# Altium schematic sheet RF PATH.SchDoc: RF PATH
size B; SheetNumber: 5; SheetTotal: 8
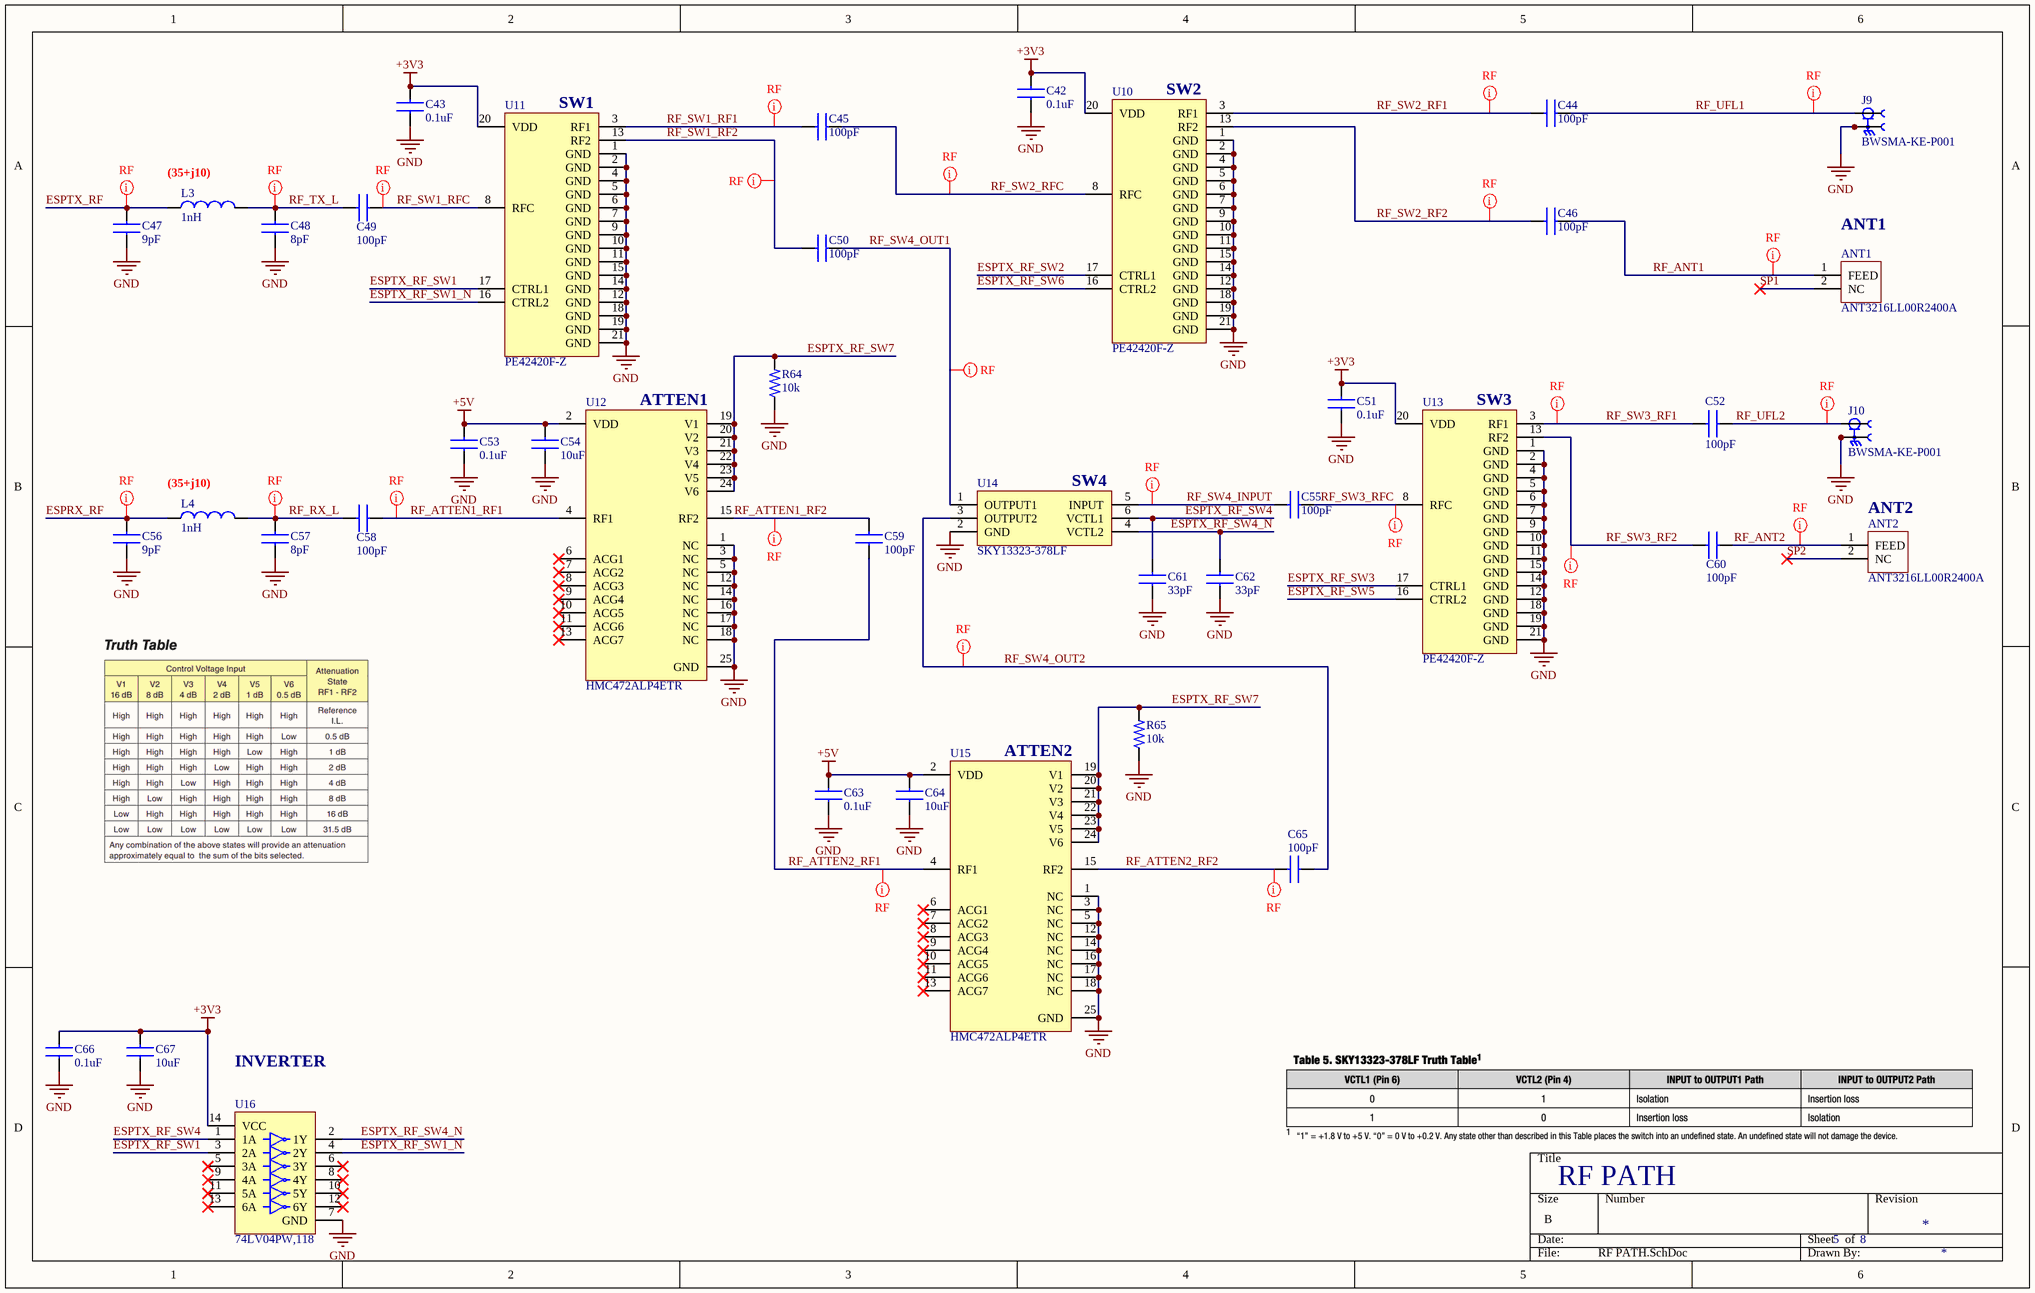
[diagram p0: RF PATH.SchDoc]

## Parts
ANT1  ANT3216LL00R2400A  [ANT_ANT3216LL00R2400A]
ANT2  ANT3216LL00R2400A  [ANT_ANT3216LL00R2400A]
C42  0.1uF  [CAP_0402]
C43  0.1uF  [CAP_0402]
C44  100pF  [CAP_0402]
C45  100pF  [CAP_0402]
C46  100pF  [CAP_0402]
C47  9pF  [CAP_0402]
C48  8pF  [CAP_0402]
C49  100pF  [CAP_0402]
C50  100pF  [CAP_0402]
C51  0.1uF  [CAP_0402]
C52  100pF  [CAP_0402]
C53  0.1uF  [CAP_0402]
C54  10uF  [CAP_0402]
C55  100pF  [CAP_0402]
C56  9pF  [CAP_0402]
C57  8pF  [CAP_0402]
C58  100pF  [CAP_0402]
C59  100pF  [CAP_0402]
C60  100pF  [CAP_0402]
C61  33pF  [CAP_0402]
C62  33pF  [CAP_0402]
C63  0.1uF  [CAP_0402]
C64  10uF  [CAP_0402]
C65  100pF  [CAP_0402]
C66  0.1uF  [CAP_0402]
C67  10uF  [CAP_0402]
J9  BWSMA-KE-P001  [CONN_BWSMA-KE-P001]
J10  BWSMA-KE-P001  [CONN_BWSMA-KE-P001]
L3  1nH  [INDUCTOR_0402]
L4  1nH  [INDUCTOR_0402]
R64  10k  [RES_0402]
R65  10k  [RES_0402]
U10  PE42420F-Z  [RF_PE42420F-Z]
U11  PE42420F-Z  [RF_PE42420F-Z]
U12  HMC472ALP4ETR  [IC_HMC472ALP4ETR]
U13  PE42420F-Z  [RF_PE42420F-Z]
U14  SKY13323-378LF  [RF_SW_SKYA21012]
U15  HMC472ALP4ETR  [IC_HMC472ALP4ETR]
U16  74LV04PW,118  [TSSOP14]

## Nets
+3V3: C42.2 C43.2 C51.2 C66.2 C67.2 U10.20(VDD) U11.20(VDD) U13.20(VDD) U16.14(VCC)
+5V: C53.2 C54.2 C63.2 C64.2 U12.2(VDD) U15.2(VDD)
GND: C42.1 C43.1 C47.1 C48.1 C51.1 C53.1 C54.1 C56.1 C57.1 C61.1 C62.1 C63.1 C64.1 C66.1 C67.1 J9.2 J9.3 J9.4 J9.5 J10.2 J10.3 J10.4 J10.5 R64.1 R65.1 U10.1(GND) U10.2(GND) U10.4(GND) U10.5(GND) U10.6(GND) U10.7(GND) U10.9(GND) U10.10(GND) U10.11(GND) U10.12(GND) U10.14(GND) U10.15(GND) U10.18(GND) U10.19(GND) U10.21(GND) U11.1(GND) U11.2(GND) U11.4(GND) U11.5(GND) U11.6(GND) U11.7(GND) U11.9(GND) U11.10(GND) U11.11(GND) U11.12(GND) U11.14(GND) U11.15(GND) U11.18(GND) U11.19(GND) U11.21(GND) U12.1(NC) U12.3(NC) U12.5(NC) U12.12(NC) U12.14(NC) U12.16(NC) U12.17(NC) U12.18(NC) U12.25(GND) U13.1(GND) U13.2(GND) U13.4(GND) U13.5(GND) U13.6(GND) U13.7(GND) U13.9(GND) U13.10(GND) U13.11(GND) U13.12(GND) U13.14(GND) U13.15(GND) U13.18(GND) U13.19(GND) U13.21(GND) U14.2(GND) U15.1(NC) U15.3(NC) U15.5(NC) U15.12(NC) U15.14(NC) U15.16(NC) U15.17(NC) U15.18(NC) U15.25(GND) U16.7(GND)
ESPRX_RF: C56.2 L4.1
ESPTX_RF: C47.2 L3.1
ESPTX_RF_SW1: U11.17(CTRL1) U16.3(2A)
ESPTX_RF_SW1_N: U11.16(CTRL2) U16.4(2Y)
ESPTX_RF_SW2: U10.17(CTRL1)
ESPTX_RF_SW3: U13.17(CTRL1)
ESPTX_RF_SW4: C61.2 U14.6(VCTL1) U16.1(1A)
ESPTX_RF_SW4_N: C62.2 U14.4(VCTL2) U16.2(1Y)
ESPTX_RF_SW5: U13.16(CTRL2)
ESPTX_RF_SW6: U10.16(CTRL2)
ESPTX_RF_SW7: R64.2 R65.2 U12.19(V1) U12.20(V2) U12.21(V3) U12.22(V4) U12.23(V5) U12.24(V6) U15.19(V1) U15.20(V2) U15.21(V3) U15.22(V4) U15.23(V5) U15.24(V6)
RF_ANT1: ANT1.1(FEED) C46.2
RF_ANT2: ANT2.1(FEED) C60.1
RF_ATTEN1_RF1: C58.1 U12.4(RF1)
RF_ATTEN1_RF2: C59.2 U12.15(RF2)
RF_ATTEN2_RF1: C59.1 U15.4(RF1)
RF_ATTEN2_RF2: C65.2 U15.15(RF2)
RF_RX_L: C57.2 C58.2 L4.2
RF_SW1_RF1: C45.1 U11.3(RF1)
RF_SW1_RF2: C50.2 U11.13(RF2)
RF_SW1_RFC: C49.1 U11.8(RFC)
RF_SW2_RF1: C44.1 U10.3(RF1)
RF_SW2_RF2: C46.1 U10.13(RF2)
RF_SW2_RFC: C45.2 U10.8(RFC)
RF_SW3_RF1: C52.1 U13.3(RF1)
RF_SW3_RF2: C60.2 U13.13(RF2)
RF_SW3_RFC: C55.1 U13.8(RFC)
RF_SW4_INPUT: C55.2 U14.5(INPUT)
RF_SW4_OUT1: C50.1 U14.1(OUTPUT1)
RF_SW4_OUT2: C65.1 U14.3(OUTPUT2)
RF_TX_L: C48.2 C49.2 L3.2
RF_UFL1: C44.2 J9.1
RF_UFL2: C52.2 J10.1
SP1: ANT1.2(NC)
SP2: ANT2.2(NC)

Not connected (* = marked no-connect by the designer): U12 6(ACG1)* 7(ACG2)* 8(ACG3)* 9(ACG4)* 10(ACG5)* 11(ACG6)* 13(ACG7)*; U15 6(ACG1)* 7(ACG2)* 8(ACG3)* 9(ACG4)* 10(ACG5)* 11(ACG6)* 13(ACG7)*; U16 5(3A)* 6(3Y)* 8(4Y)* 9(4A)* 10(5Y)* 11(5A)* 12(6Y)* 13(6A)*

## Layout directives
net class RF: ESPRX_RF, ESPTX_RF, RF_ANT1, RF_ANT2, RF_ATTEN1_RF1, RF_ATTEN1_RF2, RF_ATTEN2_RF1, RF_ATTEN2_RF2, RF_RX_L, RF_SW1_RF1, RF_SW1_RF2, RF_SW1_RFC, RF_SW2_RF1, RF_SW2_RF2, RF_SW2_RFC, RF_SW3_RF1, RF_SW3_RF2, RF_SW3_RFC, RF_SW4_INPUT, RF_SW4_OUT1, RF_SW4_OUT2, RF_TX_L, RF_UFL1, RF_UFL2

## Notes on the sheet
- (near U10) SW2
- (near U11) SW1
- (near L3) (35+j10)
- (near ANT1) ANT1
- (near U12) ATTEN1
- (near U13) SW3
- (near L4) (35+j10)
- (near U14) SW4
- (near ANT2) ANT2
- (near U15) ATTEN2
- INVERTER

## Library data of the parts
ANT1 ANT2 = ANT_ANT3216LL00R2400A: Chip Antenna Linear Single Band 50Ohm 2.4GHz 5.05dBi 2-Pin SMD T/R; Manufacturer: Yageo; Number of Bands: 1; Max Power Dissipation: 1W; Supplier 1: Digi-Key; Manufacturer Part Number: ANT3216LL00R2400A; RoHS: Yes; Category: RF Antennas; Mount: Surface Mount; Packaging: Cut Tape; Termination: Solder; ComponentLink1URL: http://www.yageo.com/NewPortal/_en/search/productDocs.jsp?YageoPartNumber=ANT3216LL00R2400A&src-supplier=Digi-Key; ComponentLink1Description: http://www.yageo.com/NewPortal/_en/search/productDocs.jsp?YageoPartNumber=ANT3216LL00R2400A&src-supplier=Digi-Key; Supplier Part Number 1: 311-4590-2-ND
C42 C43 C51 C53 C63 C66 = CAP_GCM155R71C104KA55J: Cap Ceramic 0.1uF 16V X7R 10% SMD 0402 125C Paper T/R; Manufacturer: Murata; Capacitance: 100nF; Supplier 1: Digi-Key; Manufacturer Part Number: GCM155R71C104KA55J; RoHS: Yes; Category: Ceramic Capacitors; Stock 1: 10738061; Pricing 1: 1=0.10000, 10=0.03500, 50=0.01920, 100=0.01560, 500=0.01116, 1000=0.00877, 2500=0.00798, 5000=0.00734 (USD); Mount: Surface Mount; Case/Package: 0402; Case Code (Imperial): 0402; Case Code (Metric): 1005; Min Operating Temperature: -55°C; Max Operating Temperature: 125°C; Tolerance: 10%; Voltage Rating: 16V; Voltage Rating (DC): 16V; Packaging: Tape and Reel; Package Quantity: 1; Dielectric: X7R; Termination: SMD/SMT; Series: GCM; Construction: Flat; Length: 1mm; Width: 0.5mm; Height: 0.5mm; Thickness: 0.022inch; Depth: 0.5mm; Ratings: AEC-Q200; Radiation Hardening: No; Lead Free: Lead Free; ComponentLink1URL: https://datasheet.ciiva.com/11618/product-11618848.pdf?src-supplier=Avnet; ComponentLink1Description: https://datasheet.ciiva.com/11618/product-11618848.pdf?src-supplier=Avnet; ComponentLink2URL: https://datasheet.ciiva.com/16440/gcm155r71c104ka55j-16440393.pdf?src-supplier=Future+Electronics; ComponentLink2Description: https://datasheet.ciiva.com/16440/gcm155r71c104ka55j-16440393.pdf?src-supplier=Future+Electronics; ComponentLink3URL: https://datasheet.ciiva.com/29542/product-29542474.pdf?src-supplier=Digi-Key; ComponentLink3Description: https://datasheet.ciiva.com/29542/product-29542474.pdf?src-supplier=Digi-Key; ComponentLink4URL: https://datasheet.ciiva.com/29542/product-29542475.pdf?src-supplier=Digi-Key; ComponentLink4Description: https://datasheet.ciiva.com/29542/product-29542475.pdf?src-supplier=Digi-Key; Supplier Part Number 1: 490-7998-1-ND
C44-C46 C49 C50 C52 C55 C58-C60 C65 = CAP_CC0402JRNPO9BN101: 0402 100 pF 50 V ±5 % Tolerance NP0 SMT Multilayer Ceramic Capacitor; Manufacturer: Yageo; Tolerance: 5%; Voltage Rating: 50V; Dielectric: C0G; Temperature Coefficient: 30ppm/°C; Insulation Resistance: 100GR; Supplier 1: Digi-Key; Manufacturer Part Number: CC0402JRNPO9BN101; RoHS: Yes; Category: Ceramic Capacitors; Stock 1: 12718535; Pricing 1: 1=0.1, 10=0.017, 50=0.0096, 100=0.0078, 500=0.00554, 1000=0.00436, 2500=0.00396, 5000=0.00365 (USD); Mounting Technology: Surface Mount; Case/Package: 0402; Pins: 2; Case Code (Imperial): 0402; Case Code (Metric): 1005; Dielectric Material: Ceramic; Min Operating Temperature: -55°C; Max Operating Temperature: 125°C; Value: 100pF; Voltage Rating (DC): 50V; Packaging: Tape and Reel; Package Quantity: 1; Termination: SMD/SMT; Voltage: 50V; Series: CC; Length: 1mm; Width: 0.02inch; Height: 0.5mm; Thickness: 0.022inch; Depth: 0.5mm; Radiation Hardening: No; Reach SVHC Compliant: No; Lead Free: Lead Free; RoHS Compliant: Yes; ComponentLink1URL: https://datasheet.ciiva.com/23767/25787-23767888.pdf?src-supplier=Newark; ComponentLink1Description: https://datasheet.ciiva.com/23767/25787-23767888.pdf?src-supplier=Newark; ComponentLink2URL: https://datasheet.ciiva.com/11786/0900766b80d84fbf-11786101.pdf?src-supplier=Rs; ComponentLink2Description: https://datasheet.ciiva.com/11786/0900766b80d84fbf-11786101.pdf?src-supplier=Rs; ComponentLink3URL: https://datasheet.ciiva.com/28450/1443161-28450220.pdf?src-supplier=Element14; ComponentLink3Description: https://datasheet.ciiva.com/28450/1443161-28450220.pdf?src-supplier=Element14; ComponentLink4URL: https://datasheet.ciiva.com/8033/1443161-8033598.pdf?src-supplier=Element14; ComponentLink4Description: https://datasheet.ciiva.com/8033/1443161-8033598.pdf?src-supplier=Element14; ComponentLink5URL: https://datasheet.ciiva.com/143/mlccorderingcode-143990.pdf?src-supplier=Digi-Key; ComponentLink5Description: https://datasheet.ciiva.com/143/mlccorderingcode-143990.pdf?src-supplier=Digi-Key; ComponentLink6URL: https://datasheet.ciiva.com/143/mlccorderingcode-143989.pdf?src-supplier=Digi-Key; ComponentLink6Description: https://datasheet.ciiva.com/143/mlccorderingcode-143989.pdf?src-supplier=Digi-Key; ComponentLink7URL: https://datasheet.ciiva.com/143/mlccorderingcode-143991.pdf?src-supplier=Digi-Key; ComponentLink7Description: https://datasheet.ciiva.com/143/mlccorderingcode-143991.pdf?src-supplier=Digi-Key; Supplier Part Number 1: 311-1024-1-ND
C47 C56 = CAP_GJM1555C1H9R0WB01D: Cap Ceramic 9pF 50V C0G 0.05pF SMD 0402 125°C Paper T/R; Manufacturer: Murata; Supplier 1: Digi-Key; Manufacturer Part Number: GJM1555C1H9R0WB01D; RoHS: Yes; Category: Ceramic Capacitors; Stock 1: 62783; Pricing 1: 1=0.19, 10=0.131, 50=0.0786, 100=0.0664, 500=0.04542, 1000=0.04019, 2500=0.03844, 5000=0.03495 (USD); Mounting Technology: Surface Mount; Case/Package: 0402; Case Code (Metric): 1005; Case Code (Imperial): 0402; Min Operating Temperature: -55°C; Max Operating Temperature: 125°C; Package Quantity: 10000; Value: 9pF; Voltage Rating: 50V; Packaging: Tape and Reel; Dielectric: C0G; Termination: SMD/SMT; Voltage Rating (DC): 50V; Series: GJM; Construction: Flat; Length: 1mm; Width: 0.02inch; Height: 0.5mm; Thickness: 0.022inch; Depth: 0.5mm; Radiation Hardening: No; RoHS Compliant: Yes; ComponentLink1URL: https://datasheet.ciiva.com/169/product-169670.pdf?src-supplier=Digi-Key; ComponentLink1Description: https://datasheet.ciiva.com/169/product-169670.pdf?src-supplier=Digi-Key; ComponentLink2URL: https://datasheet.ciiva.com/11609/product-11609469.pdf?src-supplier=Avnet; ComponentLink2Description: https://datasheet.ciiva.com/11609/product-11609469.pdf?src-supplier=Avnet; Supplier Part Number 1: 490-11242-1-ND
C48 C57 = CAP_CBR04C809B1GAC: Cap Ceramic 8pF 100V C0G 0.1pF SMD 0402 125°C Punched Paper T/R; Manufacturer: KEMET; Supplier 1: Digi-Key; Manufacturer Part Number: CBR04C809B1GAC; RoHS: Yes; Category: Ceramic Capacitors; Stock 1: 120216; Pricing 1: 1=0.31, 10=0.214, 50=0.1426, 100=0.1212, 500=0.08556, 1000=0.07487, 2500=0.0713, 5000=0.06596 (USD); Mounting Technology: Surface Mount; Case/Package: 0402; Case Code (Metric): 1005; Case Code (Imperial): 0402; Min Operating Temperature: -55°C; Max Operating Temperature: 125°C; Package Quantity: 1; Value: 8pF; Voltage Rating: 100V; Packaging: Cut Tape; Voltage Rating (DC): 100V; Series: CBR; Length: 0.039inch; Width: 0.02inch; Thickness: 0.022inch; RoHS Compliant: Yes; ComponentLink1URL: https://datasheet.ciiva.com/6257/kem-c1030-cbr-smd-6257486.pdf?src-supplier=Digi-Key; ComponentLink1Description: https://datasheet.ciiva.com/6257/kem-c1030-cbr-smd-6257486.pdf?src-supplier=Digi-Key; Supplier Part Number 1: 399-8830-1-ND
C54 C64 C67 = CAP_CL05A106MQ5NUNC: Cap Ceramic 10uF 6.3V X5R 20% SMD 0402 85°C Paper T/R; Manufacturer: Samsung; Supplier 1: Digi-Key; Manufacturer Part Number: CL05A106MQ5NUNC; RoHS: Yes; Category: Ceramic Capacitors; Stock 1: 3345553; Pricing 1: 1=0.27000, 10=0.18400, 50=0.11020, 100=0.09300, 500=0.06362, 1000=0.05629, 2500=0.05384, 5000=0.04894 (USD); Mount: Surface Mount; Case/Package: 0402; Case Code (Metric): 1005; Case Code (Imperial): 0402; Min Operating Temperature: -55°C; Max Operating Temperature: 85°C; Tolerance: 20%; Capacitance: 10uF; Dielectric: X5R; Packaging: Tape and Reel; Package Quantity: 1; Voltage Rating: 6.3V; Series: CL; Construction: Flat; Length: 1mm; Width: 0.02inch; Height: 0.5mm; Thickness: 0.028inch; Depth: 0.5mm; Radiation Hardening: No; ComponentLink1URL: https://datasheet.ciiva.com/16437/cl05a106mq5nunc-16437356.pdf?src-supplier=Future+Electronics; ComponentLink1Description: https://datasheet.ciiva.com/16437/cl05a106mq5nunc-16437356.pdf?src-supplier=Future+Electronics; ComponentLink2URL: https://datasheet.ciiva.com/26877/getdatasheetpartid-355289-26877841.pdf?src-supplier=Verical; ComponentLink2Description: https://datasheet.ciiva.com/26877/getdatasheetpartid-355289-26877841.pdf?src-supplier=Verical; Supplier Part Number 1: 1276-1451-1-ND
C61 C62 = CAP_CL05C330JB5NNNC: Ceramic capacitor SMD-0402 33pF /50V C0G# J +-5%, Samsung, RoHS; Tolerance: 5%; Voltage Rating: 50V; Dielectric: C0G; Temperature Coefficient: 300ppm/°C; Supplier 1: Digi-Key; Manufacturer: Samsung; Manufacturer Part Number: CL05C330JB5NNNC; RoHS: Yes; Category: Ceramic Capacitors; Stock 1: 9061474; Pricing 1: 1=0.1, 10=0.023, 50=0.0126, 100=0.0102, 500=0.00732, 1000=0.00575, 2500=0.00523, 5000=0.00481 (USD); Mounting Technology: Surface Mount; Case/Package: 0402; Case Code (Metric): 1005; Case Code (Imperial): 0402; Material: Ceramic; Min Operating Temperature: -55°C; Max Operating Temperature: 125°C; Package Quantity: 1; Packaging: Tape and Reel; Value: 33pF; Voltage: 50V; Voltage Rating (DC): 50V; Series: CL; Construction: Flat; Length: 1mm; Width: 0.02inch; Height: 0.5mm; Thickness: 0.022inch; Depth: 0.5mm; Radiation Hardening: No; Lead Free: Lead Free; RoHS Compliant: Yes; ComponentLink1URL: https://datasheet.ciiva.com/15195/getdatasheetpartid-355282-15195687.pdf?src-supplier=Verical; ComponentLink1Description: https://datasheet.ciiva.com/15195/getdatasheetpartid-355282-15195687.pdf?src-supplier=Verical; ComponentLink2URL: https://datasheet.ciiva.com/29198/458594-da-01-en-vs-kondensator-0402-29198402.pdf?src-supplier=Conrad; ComponentLink2Description: https://datasheet.ciiva.com/29198/458594-da-01-en-vs-kondensator-0402-29198402.pdf?src-supplier=Conrad; Supplier Part Number 1: 1276-1272-1-ND
J9 J10 = CONN_BWSMA-KE-P001: 0-12.4GHz 50Ω 335V 直插偏脚; Manufacturer: BAT Wireless; Supplier 1: LCSC; Manufacturer Part Number: BWSMA-KE-P001; RoHS: No; Stock 1: 21382; Pricing 1: 1=0.3453, 10=0.2721, 30=0.2355, 100=0.2037, 500=0.1957, 1000=0.1894 (USD); Supplier Part Number 1: C496550
L3 L4 = L_LQG15HS1N0S02D: Inductor RF Chip Multi-Layer 1nH 0.3nH 100MHz 8Q-Factor Air 1A 70mOhm DCR 0402 T/R; Manufacturer: Murata; Q Factor: 8; Current Rating: 300mA; Shielding: Unshielded; Self Resonant Frequency: 10GHz; DC Resistance (DCR): 70mR; Supplier 1: LCSC; Manufacturer Part Number: LQG15HS1N0S02D; RoHS: Yes; Category: Fixed Inductors; Stock 1: 12000; Pricing 1: 100=0.0076, 1000=0.0064, 3000=0.0057, 10000=0.004, 50000=0.0036, 100000=0.0035 (USD); Mounting Technology: Surface Mount; Case/Package: 0402; Core Material: Air; Case Code (Metric): 1005; Case Code (Imperial): 0402; Min Operating Temperature: -55°C; Max Operating Temperature: 125°C; Packaging: Tape and Reel; Package Quantity: 1; Value: 1nH; Test Frequency: 100MHz; Max DC Current: 300mA; Termination: SMD/SMT; DC Current: 300mA; Series: LQG15HS; Max Current Rating: 300mA; Length: 1mm; Width: 0.02inch; Height: 0.5mm; Height - Seated (Max): 0.022inch; Depth: 0.55mm; Radiation Hardening: No; Military Standard: Not; Lead Free: Lead Free; RoHS Compliant: Yes; ComponentLink1URL: https://datasheet.ciiva.com/27054/1864353-27054316.pdf?src-supplier=Jameco; ComponentLink1Description: https://datasheet.ciiva.com/27054/1864353-27054316.pdf?src-supplier=Jameco; ComponentLink2URL: https://datasheet.ciiva.com/1038/l0075s0083lqg15hs-1038134.pdf?src-supplier=Digi-Key; ComponentLink2Description: https://datasheet.ciiva.com/1038/l0075s0083lqg15hs-1038134.pdf?src-supplier=Digi-Key; ComponentLink3URL: https://datasheet.ciiva.com/1038/l0075s0083lqg15hs-1038133.pdf?src-supplier=Digi-Key; ComponentLink3Description: https://datasheet.ciiva.com/1038/l0075s0083lqg15hs-1038133.pdf?src-supplier=Digi-Key; ComponentLink4URL: https://datasheet.ciiva.com/1038/l0075s0083lqg15hs-1038135.pdf?src-supplier=Digi-Key; ComponentLink4Description: https://datasheet.ciiva.com/1038/l0075s0083lqg15hs-1038135.pdf?src-supplier=Digi-Key; ComponentLink5URL: https://datasheet.ciiva.com/4979/o05e-4979757.pdf?src-supplier=Mouser; ComponentLink5Description: https://datasheet.ciiva.com/4979/o05e-4979757.pdf?src-supplier=Mouser; ComponentLink6URL: https://datasheet.ciiva.com/3082/l0075s0083lqg15hs-3082177.pdf?src-supplier=Avnet; ComponentLink6Description: https://datasheet.ciiva.com/3082/l0075s0083lqg15hs-3082177.pdf?src-supplier=Avnet; Supplier Part Number 1: C18222
R64 R65 = RES_AC0402FR-0710KL: RES SMD 10K OHM 1% 1/16W 0402; Manufacturer: Yageo; Resistance: 10kR; Power Rating: 62.5mW; Voltage Rating: 50V; Temperature Coefficient: 100ppm/°C; Max Power Dissipation: 63mW; Supplier 1: Digi-Key; Manufacturer Part Number: AC0402FR-0710KL; RoHS: Yes; Category: Chip SMD Resistors; Stock 1: 2860; Pricing 1: 1=0.10000, 10=0.02200, 100=0.00900, 1000=0.00402, 2500=0.00349, 5000=0.00288 (USD); Case/Package: 0402; Case Code (Imperial): 0402; Case Code (Metric): 1005; Size Code: 0402; Min Operating Temperature: -55°C; Max Operating Temperature: 155°C; Tolerance: 1%; Packaging: Tape and Reel; Resistor Type: Thick Film; Termination: SMD/SMT; Number of Terminations: 2; Features: Moisture Resistant,Automotive AEC-Q200; Series: AC; Construction: Rectangular; Length: 0.039inch; Width: 0.02inch; Height: 0.015inch; Depth: 0.5mm; Military Standard: Not; Lead Free: Lead Free; RoHS Compliant: Yes; ComponentLink1URL: https://datasheet.ciiva.com/12656/pyu-ac-51-rohs-l-2-12656634.pdf?src-supplier=Mouser; ComponentLink1Description: https://datasheet.ciiva.com/12656/pyu-ac-51-rohs-l-2-12656634.pdf?src-supplier=Mouser; Supplier Part Number 1: YAG3436CT-ND
U10 U11 U13 = RF_PE42420F-Z: RF Switch, SPDT, 0.03 to 6 GHz, 0.95 dB IL, 70 dB Isolation, 45.4 dBm Pwr Rating, QFN; Manufacturer: pSemi; Supplier 1: Digi-Key; Manufacturer Part Number: PE42420F-Z; RoHS: No; Category: Uncategorized; Stock 1: 19071; Pricing 1: 1=2.32, 100=2.145 (USD); Supplier Part Number 1: 1046-1158-1-ND
U12 U15 = IC_HMC472ALP4ETR: RF Attenuator 31.5dB ±0.35dB 0 ~ 3.8GHz 50 Ohm 560mW 24-VFQFN Exposed Pad; Manufacturer: Analog Devices; Impedance: 50R; Number of Bits: 6; Number of Channels: 1; Insertion Loss: 3dB; Operating Supply Voltage: 5V; Supplier 1: LCSC; Manufacturer Part Number: HMC472ALP4ETR; RoHS: Yes; Category: RF Semiconductors and Devices; Stock 1: 927; Pricing 1: 1=2.2846, 10=1.9791, 30=1.7882, 100=1.4844, 500=1.3969, 1000=1.3587 (USD); Case/Package: SMD/SMT; Pins: 24; Weight: 0.032741oz; Min Operating Temperature: -40°C; Max Operating Temperature: 85°C; Package Quantity: 500; Max Power Dissipation: 560mW; Packaging: Tape and Reel; Series: -; Attenuation Value: 31.5dB; Clock Frequency: 3.8GHz; Technology: GAAS; Lead Free: Contains Lead; RoHS Compliant: Yes; ComponentLink1URL: https://datasheet.ciiva.com/46637/qtr-2013-00285-46637115.pdf?src-supplier=Digi-Key; ComponentLink1Description: https://datasheet.ciiva.com/46637/qtr-2013-00285-46637115.pdf?src-supplier=Digi-Key; ComponentLink2URL: https://datasheet.ciiva.com/46637/qtr-2013-00285-46637114.pdf?src-supplier=Digi-Key; ComponentLink2Description: https://datasheet.ciiva.com/46637/qtr-2013-00285-46637114.pdf?src-supplier=Digi-Key; ComponentLink3URL: https://datasheet.ciiva.com/46637/qtr-2013-00285-46637116.pdf?src-supplier=Digi-Key; ComponentLink3Description: https://datasheet.ciiva.com/46637/qtr-2013-00285-46637116.pdf?src-supplier=Digi-Key; Supplier Part Number 1: C208585
U14 = RF_SKY13323-378LF: RF Switch SPDT 100MHz to 3GHz 24dB Automotive 6-Pin QFN EP T/R / IC SPDT 100MHZ-3GHZ 6-MLPD; Manufacturer: Skyworks Solutions; Impedance: 50R; Insertion Loss: 0.35dB; P1dB: 27dBm; IIP3: 50dBm; Number of Switches: 1; Supplier 1: LCSC; Manufacturer Part Number: SKY13323-378LF; RoHS: Yes; Category: RF Semiconductors and Devices; Stock 1: 18148; Pricing 1: 1=0.322, 10=0.2602, 30=0.2338, 100=0.2008, 500=0.1647, 1000=0.1559 (USD); Case/Package: QFN; Min Operating Temperature: -40°C; Max Operating Temperature: 85°C; Package Quantity: 3000; Series: -; Packaging: Tape and Reel; Clock Frequency: 3GHz; Throw Configuration: SPDT; Operating Frequency: 100 MHz to 3 GHz; Test Frequency: 3GHz; RoHS Compliant: Yes; Lead Free: Lead Free; ComponentLink1URL: https://datasheet.ciiva.com/12072/201080e-33716-12072198.pdf?src-supplier=Mouser; ComponentLink1Description: https://datasheet.ciiva.com/12072/201080e-33716-12072198.pdf?src-supplier=Mouser; ComponentLink2URL: https://datasheet.ciiva.com/2799/201080e-2799483.pdf?src-supplier=Digi-Key; ComponentLink2Description: https://datasheet.ciiva.com/2799/201080e-2799483.pdf?src-supplier=Digi-Key; ComponentLink3URL: https://datasheet.ciiva.com/8155/201080e-8155659.pdf?src-supplier=Avnet; ComponentLink3Description: https://datasheet.ciiva.com/8155/201080e-8155659.pdf?src-supplier=Avnet; Supplier Part Number 1: C150867
U16 = IC_74LV04PW,118: IC HEX INVERTER 14TSSOP; Manufacturer: Nexperia; Supplier 1: LCSC; Manufacturer Part Number: 74LV04PW,118; RoHS: Yes; Category: Logic Gates; Stock 1: 9740; Pricing 1: 5=0.1694, 50=0.1449, 150=0.1411, 500=0.1353 (USD); RoHS Compliant: Yes; Supplier Part Number 1: C547867